# Altium schematic sheet Sheet1.SchDoc
size A2
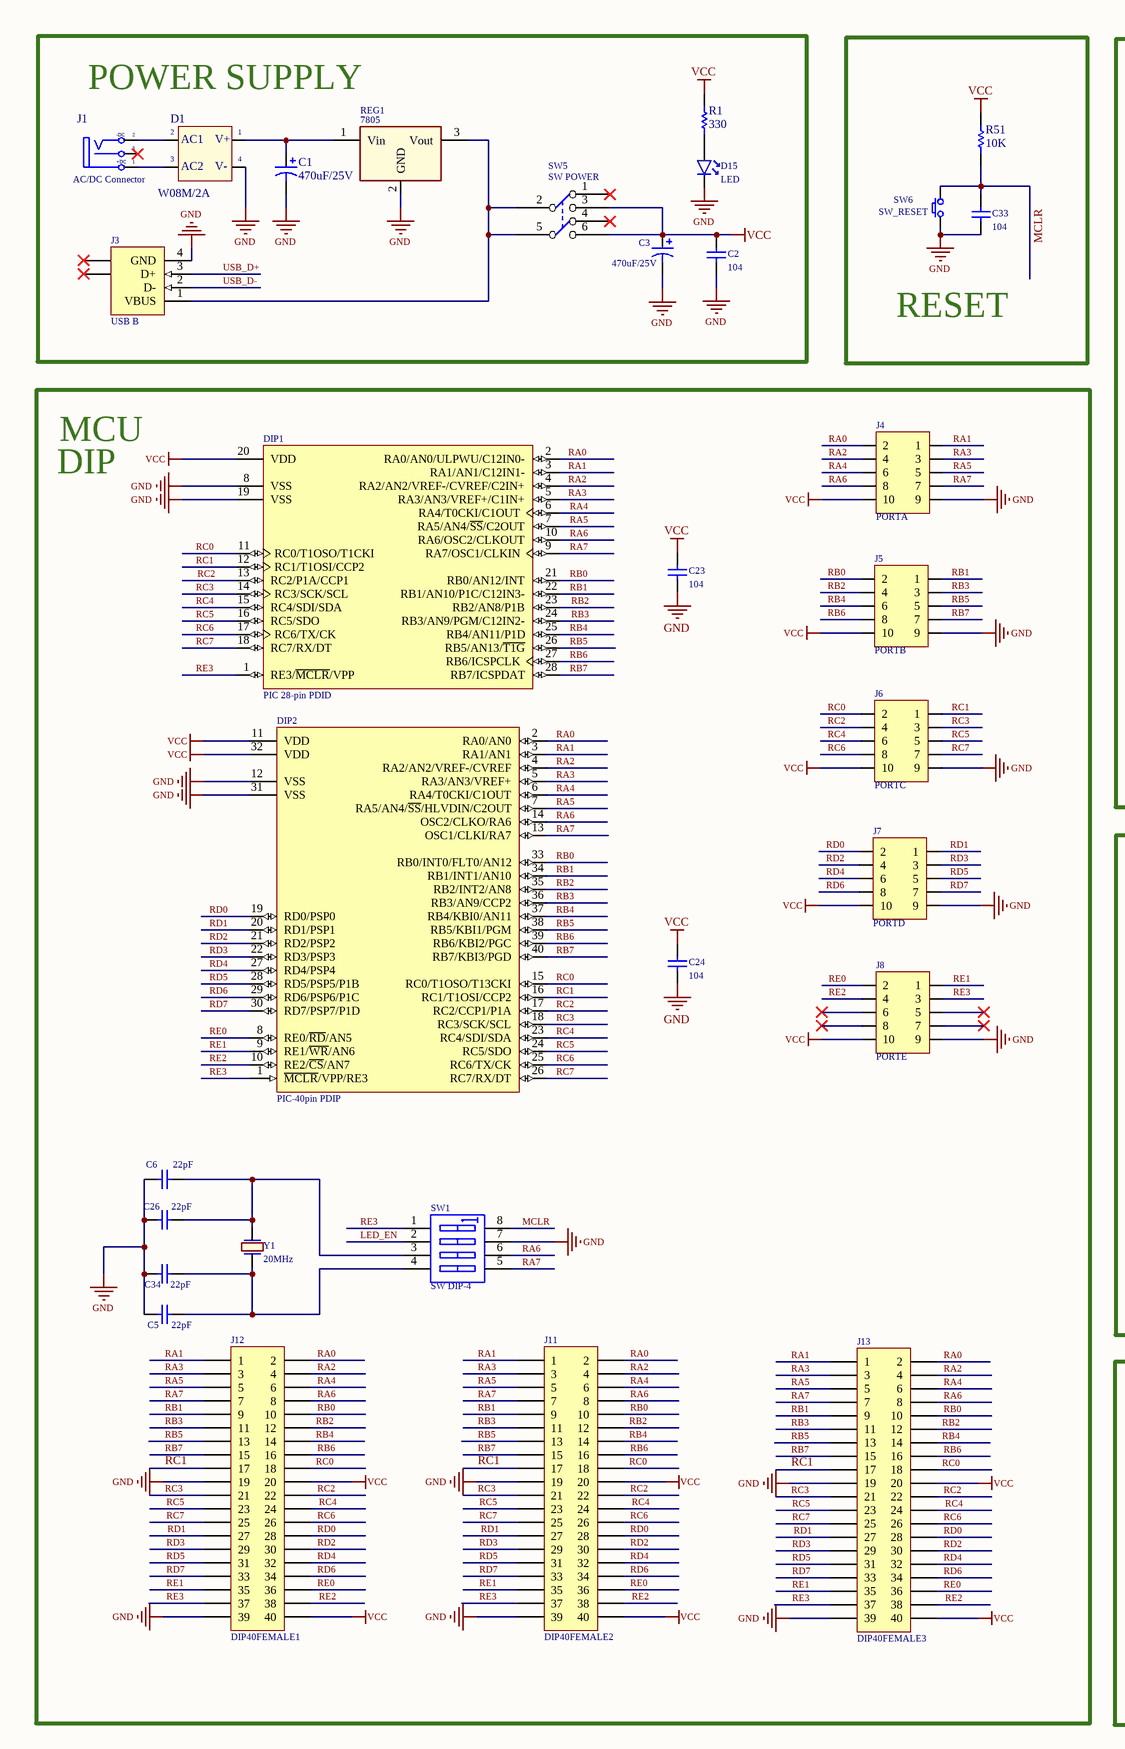
[diagram p0: Sheet1.SchDoc, left]
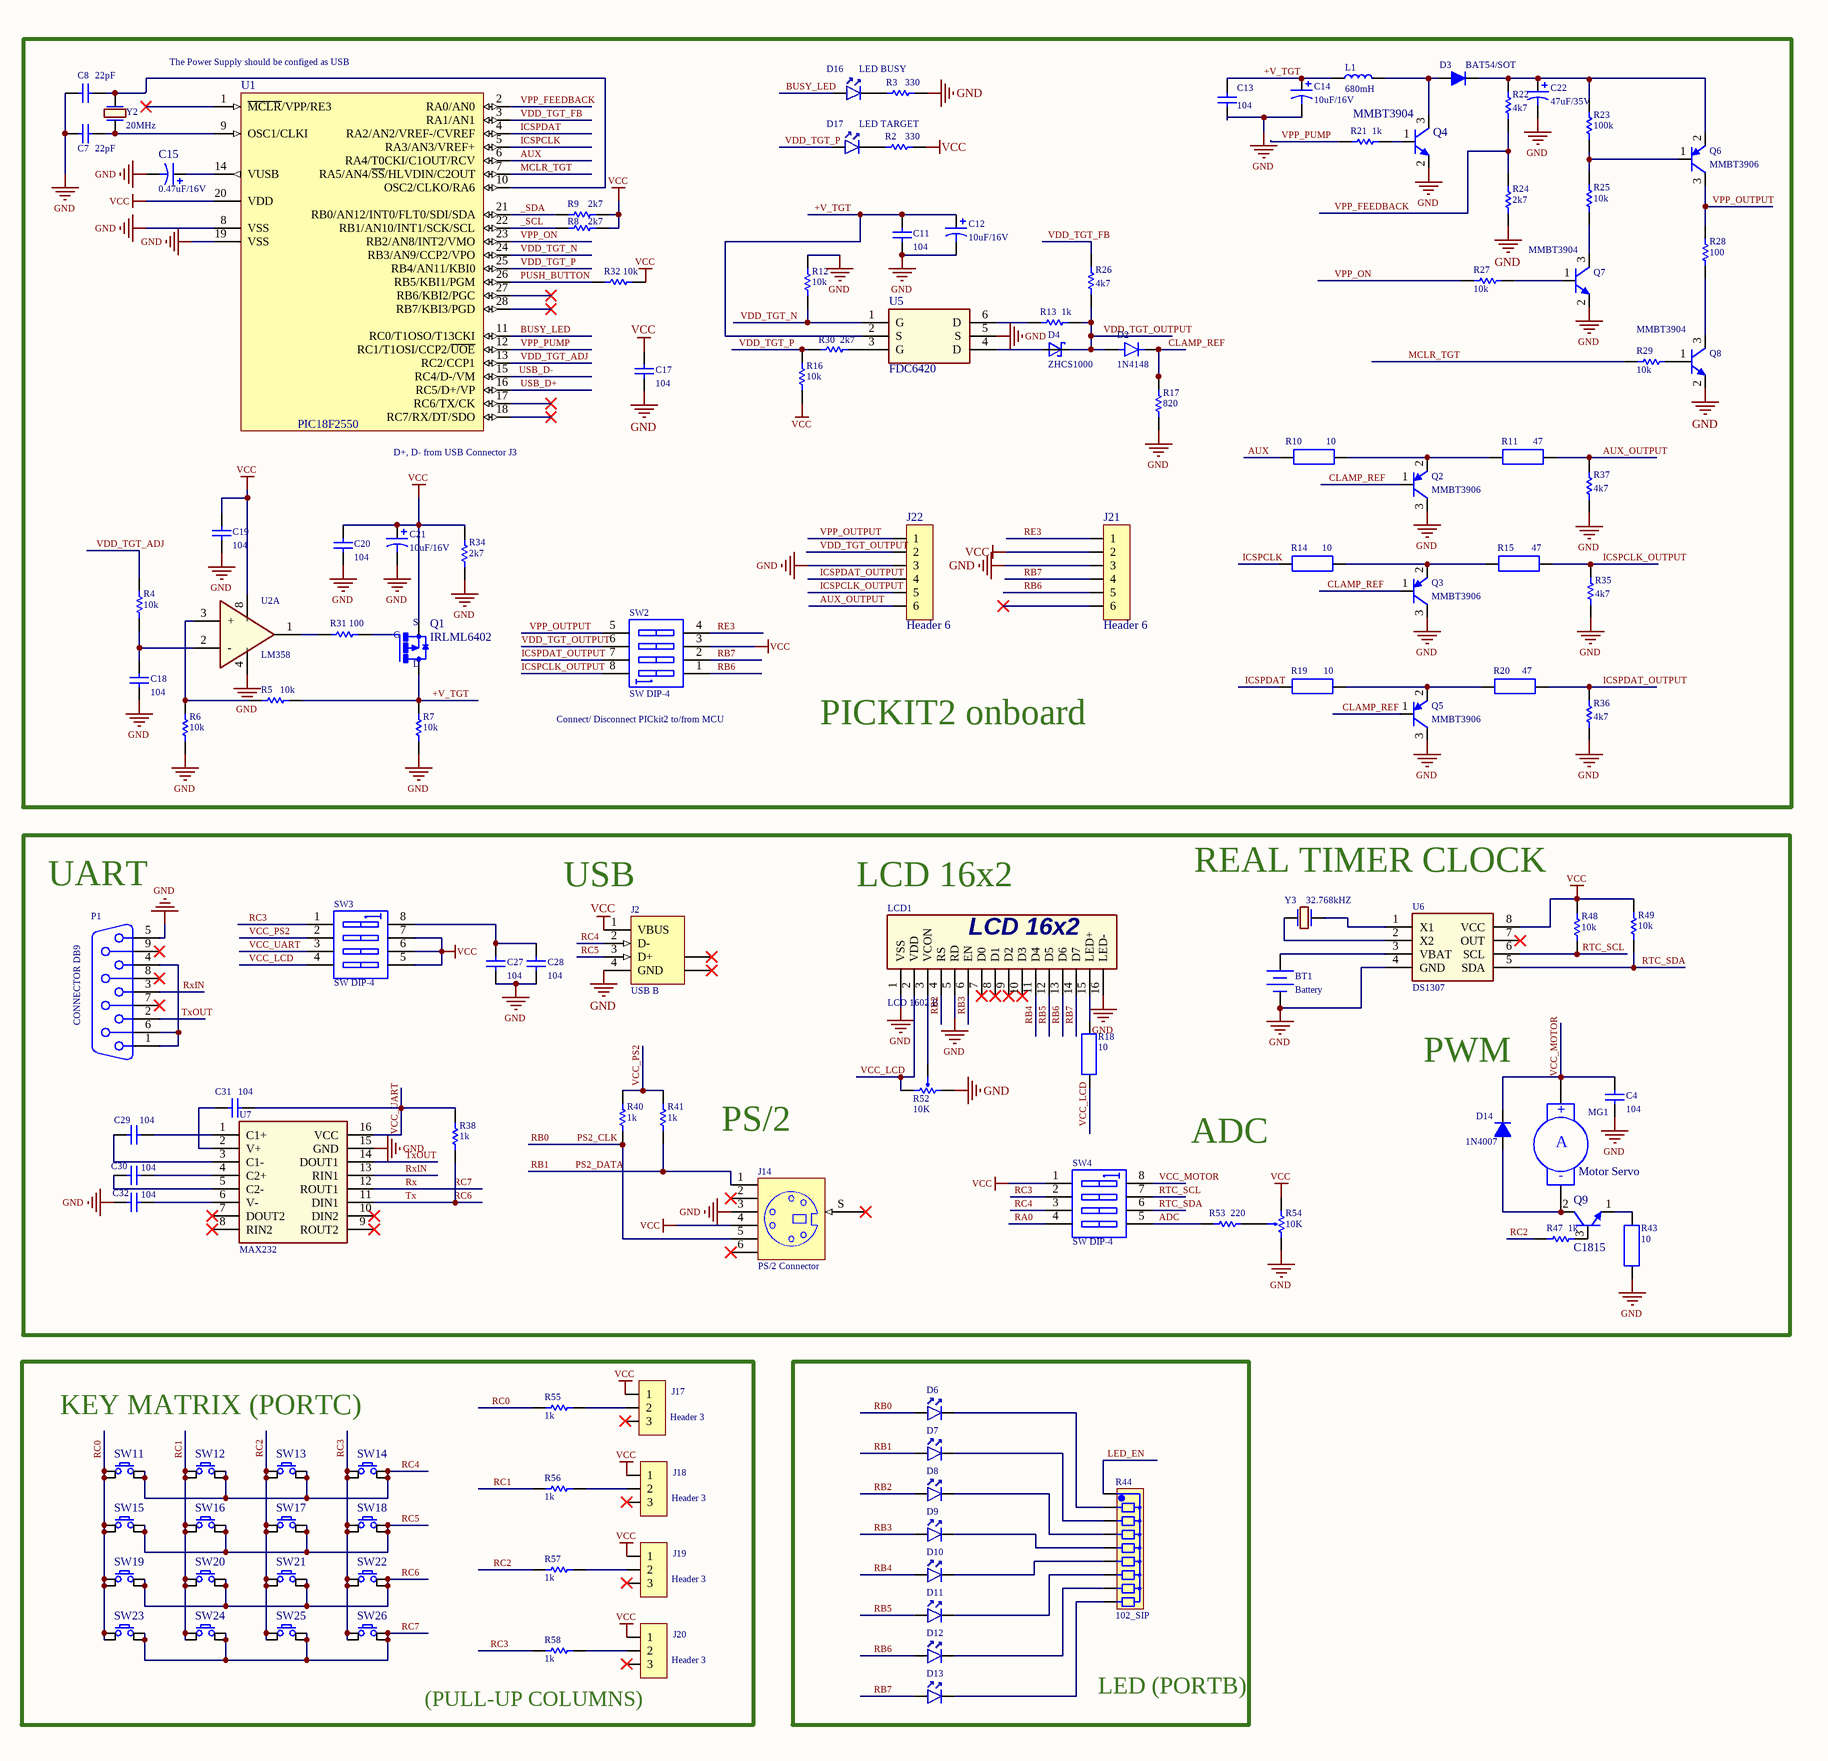
[diagram p1: Sheet1.SchDoc, right]

## Parts
BT1  Battery  [CON CR2032]
C1  470uF/25V  [CYL/D.300/LS.150/.031]
C2  104  [C 104]
C3  470uF/25V  [CYL/D.300/LS.150/.031]
C4  104  [C 0805 (2012)]
C5  22pF  [C 0805 (2012)]
C6  22pF  [C 0805 (2012)]
C7  22pF  [C 0805 (2012)]
C8  22pF  [C 0805 (2012)]
C11  104  [C 0805 (2012)]
C12  10uF/16V  [C5mm]
C13  104  [C 0805 (2012)]
C14  10uF/16V  [C5mm]
C15  0.47uF/16V  [C5mm]
C17  104  [C 0805 (2012)]
C18  104  [C 0805 (2012)]
C19  104  [C 0805 (2012)]
C20  104  [C 0805 (2012)]
C21  10uF/16V  [C5mm]
C22  47uF/35V  [C5mm]
C23  104  [C 0805 (2012)]
C24  104  [C 0805 (2012)]
C26  22pF  [C 0805 (2012)]
C27  104  [C 0805 (2012)]
C28  104  [C 0805 (2012)]
C29  104  [C 0805 (2012)]
C30  104  [C 0805 (2012)]
C31  104  [C 0805 (2012)]
C32  104  [C 0805 (2012)]
C33  104  [C 0805 (2012)]
C34  22pF  [C 0805 (2012)]
D1  W08M/2A  [BRIDGE DIODE 2A]
D2  1N4148  [SOT-23]
D3  BAT54/SOT  [SOT-23]
D4  ZHCS1000  [SOT-23]
D6  IR LED  [LED 3MM]  (value not drawn)
D7  IR LED  [LED 3MM]  (value not drawn)
D8  IR LED  [LED 3MM]  (value not drawn)
D9  IR LED  [LED 3MM]  (value not drawn)
D10  IR LED  [LED 3MM]  (value not drawn)
D11  IR LED  [LED 3MM]  (value not drawn)
D12  IR LED  [LED 3MM]  (value not drawn)
D13  IR LED  [LED 3MM]  (value not drawn)
D14  1N4007  [D1A]
D15  LED  [LED 3MM]
D16  LED BUSY  [LED 3MM]
D17  LED TARGET  [LED 3MM]
DIP1  PIC 28-pin PDID  [SPDIP300-SP28]
DIP2  PIC-40pin PDIP  [PDIP600-P40]
J1  AC/DC Connector  [CON PWR 5MM]
J2  USB B  [CON USB B]
J3  USB B  [CON USB B]
J4  PORTA  [Header 5x2]
J5  PORTB  [Header 5x2]
J6  PORTC  [Header 5x2]
J7  PORTD  [Header 5x2]
J8  PORTE  [Header 5x2]
J11  DIP40FEMALE2  [HDR2X20]
J12  DIP40FEMALE1  [HDR2X20]
J13  DIP40FEMALE3  [HDR2X20]
J14  PS/2 Connector  [PS2-6PIN]
J17  Header 3  [Header 3]
J18  Header 3  [Header 3]
J19  Header 3  [Header 3]
J20  Header 3  [Header 3]
J21  Header 6  [Header 6]
J22  Header 6  [Header 6]
L1  680mH  [R 1/2W]
LCD1  LCD 1602 B  [LCD 16x2]
MG1  Motor Servo  [R 1206 (3216)]
P1  CONNECTOR DB9  [CON DB9 FEMALE ROTATY]
Q1  IRLML6402  [SOT23]
Q2  MMBT3906  [SOT-23]
Q3  MMBT3906  [SOT-23]
Q4  MMBT3904  [SOT-23]
Q5  MMBT3906  [SOT-23]
Q6  MMBT3906  [SOT-23]
Q7  MMBT3904  [SOT-23]
Q8  MMBT3904  [SOT-23]
Q9  C1815  [TO-126]
R1  330  [R 1/4W]
R2  330  [R 1/4W]
R3  330  [R 1/4W]
R4  10k  [R 1/4W]
R5  10k  [R 1/4W]
R6  10k  [R 1/4W]
R7  10k  [R 1/4W]
R8  2k7  [R 1/4W]
R9  2k7  [R 1/4W]
R10  10  [R 1/4W]
R11  47  [R 1/4W]
R12  10k  [R 1/4W]
R13  1k  [R 1/4W]
R14  10  [R 1/4W]
R15  47  [R 1/4W]
R16  10k  [R 1/4W]
R17  820  [R 1/4W]
R18  10  [R 1/4W]
R19  10  [R 1/4W]
R20  47  [R 1/4W]
R21  1k  [R 1/4W]
R22  4k7  [R 1/4W]
R23  100k  [R 1/4W]
R24  2k7  [R 1/4W]
R25  10k  [R 1/4W]
R26  4k7  [R 1/4W]
R27  10k  [R 1/4W]
R28  100  [R 1/4W]
R29  10k  [R 1/4W]
R30  2k7  [R 1/4W]
R31  100  [R 1/4W]
R32  10k  [R 1/4W]
R34  2k7  [R 1/4W]
R35  4k7  [R 1/4W]
R36  4k7  [R 1/4W]
R37  4k7  [R 1/4W]
R38  1k  [R 1/4W]
R40  1k  [R 1/4W]
R41  1k  [R 1/4W]
R43  10  [R 1/4W]
R44  102_SIP  [RN8]
R47  1k  [R 1/4W]
R48  10k  [R 1/4W]
R49  10k  [R 1/4W]
R51  10K  [R 1/4W]
R52  10K  [R VAR D]
R53  220  [R 1/4W]
R54  10K  [R VAR B]
R55  1k  [R 1/4W]
R56  1k  [R 1/4W]
R57  1k  [R 1/4W]
R58  1k  [R 1/4W]
REG1  7805  [TO-220/HeatSink]
SW1  SW DIP-4  [SW/DIP4]
SW2  SW DIP-4  [SW/DIP4]
SW3  SW DIP-4  [SW/DIP4]
SW4  SW DIP-4  [SW/DIP4]
SW5  SW POWER  [SW/6/DPDT/PUSH]
SW6  SW_RESET  [SW/2/DIP]
SW11  Tact Switch  [SW/4/SMD/SMALL]  (value not drawn)
SW12  Tact Switch  [SW/4/SMD/SMALL]  (value not drawn)
SW13  Tact Switch  [SW/4/SMD/SMALL]  (value not drawn)
SW14  Tact Switch  [SW/4/SMD/SMALL]  (value not drawn)
SW15  Tact Switch  [SW/4/SMD/SMALL]  (value not drawn)
SW16  Tact Switch  [SW/4/SMD/SMALL]  (value not drawn)
SW17  Tact Switch  [SW/4/SMD/SMALL]  (value not drawn)
SW18  Tact Switch  [SW/4/SMD/SMALL]  (value not drawn)
SW19  Tact Switch  [SW/4/SMD/SMALL]  (value not drawn)
SW20  Tact Switch  [SW/4/SMD/SMALL]  (value not drawn)
SW21  Tact Switch  [SW/4/SMD/SMALL]  (value not drawn)
SW22  Tact Switch  [SW/4/SMD/SMALL]  (value not drawn)
SW23  Tact Switch  [SW/4/SMD/SMALL]  (value not drawn)
SW24  Tact Switch  [SW/4/SMD/SMALL]  (value not drawn)
SW25  Tact Switch  [SW/4/SMD/SMALL]  (value not drawn)
SW26  Tact Switch  [SW/4/SMD/SMALL]  (value not drawn)
U1  PIC18F2550  [SPDIP300-SP28]
U2  LM358  [SOIC-8]  (part A of 2)
U5  FDC6420  [SOT-6]
U6  DS1307  [DIP 8]
U7  MAX232  [SOIC-16]
Y1  20MHz  [Crystal HC49S DIP]
Y2  20MHz  [Crystal HC49S DIP]
Y3  32.768kHZ  [Crystal DIP-2]

## Blocks framed on the sheet
POWER SUPPLY: C1-C3 D1 D15 J1 J3 R1 REG1 SW5
RESET: C33 R51 SW6
PICKIT2 onboard: C7 C8 C11-C15 C17-C22 D2-D4 D16 D17 J21 J22 L1 Q1-Q8 R2-R17 R19-R32 R34-R37 SW2 U1 U2 U5 Y2
KEY MATRIX (PORTC): J17-J20 R55-R58 SW11-SW26
LED (PORTB): D6-D13 R44

## Nets
GND: BT1.2(GND) C1.2 C2.2 C3.2 C4.2 C5.1 C6.1 C7.1 C8.1 C11.2 C12.2 C13.2 C14.2 C15.2 C17.2 C18.2 C19.2 C20.2 C21.2 C22.2 C23.2 C24.2 C26.1 C27.2 C28.2 C32.1 C33.2 C34.1 D1.4(-V_OUT) D15.2(K) DIP1.8(VSS) DIP1.19(VSS) DIP2.12(VSS) DIP2.31(VSS) J2.4(GND) J3.4(GND) J4.9 J5.9 J6.9 J7.9 J8.9 J11.19 J11.39 J12.19 J12.39 J13.19 J13.39 J14.3 J21.3 J22.3 LCD1.1(VSS) LCD1.5(RD) LCD1.16(LED-) P1.5 Q2.3(C) Q3.3(C) Q4.2(E) Q5.3(C) Q7.2(E) Q8.2(E) R3.1 R6.1 R7.1 R12.2 R17.1 R24.1 R34.1 R35.1 R36.1 R37.1 R43.1 R52.3 R54.1 REG1.2(GND) SW1.7 SW6.1 U1.8(VSS) U1.19(VSS) U2.4(GND) U5.5(S) U6.4(GND) U7.15(GND)
VCC: C2.1 C3.1 C17.1 C19.1 C20.1 C21.1 C23.1 C24.1 DIP1.20(VDD) DIP2.11(VDD) DIP2.32(VDD) J2.1(VBUS) J4.10 J5.10 J6.10 J7.10 J8.10 J11.20 J11.40 J12.20 J12.40 J13.20 J13.40 J14.4 J17.1 J18.1 J19.1 J20.1 J21.2 Q1.2(S) R1.2 R2.1 R8.2 R9.2 R16.1 R32.2 R34.2 R48.2 R49.2 R51.2 R54.3 SW2.3 SW3.5 SW3.6 SW3.7 SW4.1 SW5.3(NO1) SW5.6(NO2) U1.20(VDD) U2.8(VCC) U6.8(VCC)
+V_TGT: C11.1 C12.1 C13.1 C14.1 L1.1 Q1.3(D) R5.2 R7.2 U5.2(S)
_SCL: R8.1 U1.22(RB1/AN10/INT1/SCK/SCL)
_SDA: R9.1 U1.21(RB0/AN12/INT0/FLT0/SDI/SDA)
ADC: R53.1 SW4.5
AUX: R10.1 U1.6(RA4/T0CKI/C1OUT/RCV)
AUX_OUTPUT: J22.6 R11.2 R37.2
BUSY_LED: D16.1(A) U1.11(RC0/T1OSO/T13CKI)
CLAMP_REF: D2.C Q2.1(B) Q3.1(B) Q5.1(B) R17.2
ICSPCLK: R14.1 U1.5(RA3/AN3/VREF+)
ICSPCLK_OUTPUT: J22.5 R15.2 R35.2 SW2.8
ICSPDAT: R19.1 U1.4(RA2/AN2/VREF-/CVREF)
ICSPDAT_OUTPUT: J22.4 R20.2 R36.2 SW2.7
LED_EN: R44.1 SW1.2
MCLR: C33.1 R51.1 SW1.8 SW6.2
MCLR_TGT: R29.2 U1.7(RA5/AN4/~{SS}/HLVDIN/C2OUT)
PS2_CLK: D6.1(A) DIP1.21(RB0/AN12/INT) DIP2.33(RB0/INT0/FLT0/AN12) J5.2 J11.10 J12.10 J13.10 J14.5 R40.1  [also labelled RB0]
PS2_DATA: D7.1(A) DIP1.22(RB1/AN10/P1C/C12IN3-) DIP2.34(RB1/INT1/AN10) J5.1 J11.9 J12.9 J13.9 J14.1 R41.1  [also labelled RB1]
PUSH_BUTTON: R32.1 U1.26(RB5/KBI1/PGM)
RA0: DIP1.2(RA0/AN0/ULPWU/C12IN0-) DIP2.2(RA0/AN0) J4.2 J11.2 J12.2 J13.2 SW4.4
RA1: DIP1.3(RA1/AN1/C12IN1-) DIP2.3(RA1/AN1) J4.1 J11.1 J12.1 J13.1
RA2: DIP1.4(RA2/AN2/VREF-/CVREF/C2IN+) DIP2.4(RA2/AN2/VREF-/CVREF) J4.4 J11.4 J12.4 J13.4
RA3: DIP1.5(RA3/AN3/VREF+/C1IN+) DIP2.5(RA3/AN3/VREF+) J4.3 J11.3 J12.3 J13.3
RA4: DIP1.6(RA4/T0CKI/C1OUT) DIP2.6(RA4/T0CKI/C1OUT) J4.6 J11.6 J12.6 J13.6
RA5: DIP1.7(RA5/AN4/~{SS}/C2OUT) DIP2.7(RA5/AN4/~{SS}/HLVDIN/C2OUT) J4.5 J11.5 J12.5 J13.5
RA6: DIP1.10(RA6/OSC2/CLKOUT) DIP2.14(OSC2/CLKO/RA6) J4.8 J11.8 J12.8 J13.8 SW1.6
RA7: DIP1.9(RA7/OSC1/CLKIN) DIP2.13(OSC1/CLKI/RA7) J4.7 J11.7 J12.7 J13.7 SW1.5
RB2: D8.1(A) DIP1.23(RB2/AN8/P1B) DIP2.35(RB2/INT2/AN8) J5.4 J11.12 J12.12 J13.12 LCD1.4(RS)
RB3: D9.1(A) DIP1.24(RB3/AN9/PGM/C12IN2-) DIP2.36(RB3/AN9/CCP2) J5.3 J11.11 J12.11 J13.11 LCD1.6(EN)
RB4: D10.1(A) DIP1.25(RB4/AN11/P1D) DIP2.37(RB4/KBI0/AN11) J5.6 J11.14 J12.14 J13.14 LCD1.11(D4)
RB5: D11.1(A) DIP1.26(RB5/AN13/~{T1G}) DIP2.38(RB5/KBI1/PGM) J5.5 J11.13 J12.13 J13.13 LCD1.12(D5)
RB6: D12.1(A) DIP1.27(RB6/ICSPCLK) DIP2.39(RB6/KBI2/PGC) J5.8 J11.16 J12.16 J13.16 J21.5 LCD1.13(D6) SW2.1
RB7: D13.1(A) DIP1.28(RB7/ICSPDAT) DIP2.40(RB7/KBI3/PGD) J5.7 J11.15 J12.15 J13.15 J21.4 LCD1.14(D7) SW2.2
RC0: DIP1.11(RC0/T1OSO/T1CKI) DIP2.15(RC0/T1OSO/T13CKI) J6.2 J11.18 J12.18 J13.18 R55.2 SW11.1 SW11.4 SW15.1 SW15.4 SW19.1 SW19.4 SW23.1 SW23.4
RC1: DIP1.12(RC1/T1OSI/CCP2) DIP2.16(RC1/T1OSI/CCP2) J6.1 J11.17 J12.17 J13.17 R56.2 SW12.1 SW12.4 SW16.1 SW16.4 SW20.1 SW20.4 SW24.1 SW24.4
RC2: DIP1.13(RC2/P1A/CCP1) DIP2.17(RC2/CCP1/P1A) J6.4 J11.22 J12.22 J13.22 R47.1 R57.2 SW13.1 SW13.4 SW17.1 SW17.4 SW21.1 SW21.4 SW25.1 SW25.4
RC3: DIP1.14(RC3/SCK/SCL) DIP2.18(RC3/SCK/SCL) J6.3 J11.21 J12.21 J13.21 R58.2 SW3.1 SW4.2 SW14.1 SW14.4 SW18.1 SW18.4 SW22.1 SW22.4 SW26.1 SW26.4
RC4: DIP1.15(RC4/SDI/SDA) DIP2.23(RC4/SDI/SDA) J2.2(D-) J6.6 J11.24 J12.24 J13.24 SW4.3 SW11.2 SW11.3 SW12.2 SW12.3 SW13.2 SW13.3 SW14.2 SW14.3
RC5: DIP1.16(RC5/SDO) DIP2.24(RC5/SDO) J2.3(D+) J6.5 J11.23 J12.23 J13.23 SW15.2 SW15.3 SW16.2 SW16.3 SW17.2 SW17.3 SW18.2 SW18.3
RC6: DIP1.17(RC6/TX/CK) DIP2.25(RC6/TX/CK) J6.8 J11.26 J12.26 J13.26 R38.1 SW19.2 SW19.3 SW20.2 SW20.3 SW21.2 SW21.3 SW22.2 SW22.3 U7.11(DIN1)  [also labelled Tx]
RC7: DIP1.18(RC7/RX/DT) DIP2.26(RC7/RX/DT) J6.7 J11.25 J12.25 J13.25 SW23.2 SW23.3 SW24.2 SW24.3 SW25.2 SW25.3 SW26.2 SW26.3 U7.12(ROUT1)  [also labelled Rx]
RD0: DIP2.19(RD0/PSP0) J7.2 J11.28 J12.28 J13.28
RD1: DIP2.20(RD1/PSP1) J7.1 J11.27 J12.27 J13.27
RD2: DIP2.21(RD2/PSP2) J7.4 J11.30 J12.30 J13.30
RD3: DIP2.22(RD3/PSP3) J7.3 J11.29 J12.29 J13.29
RD4: DIP2.27(RD4/PSP4) J7.6 J11.32 J12.32 J13.32
RD5: DIP2.28(RD5/PSP5/P1B) J7.5 J11.31 J12.31 J13.31
RD6: DIP2.29(RD6/PSP6/P1C) J7.8 J11.34 J12.34 J13.34
RD7: DIP2.30(RD7/PSP7/P1D) J7.7 J11.33 J12.33 J13.33
RE0: DIP2.8(RE0/~{RD}/AN5) J8.2 J11.36 J12.36 J13.36
RE1: DIP2.9(RE1/~{WR}/AN6) J8.1 J11.35 J12.35 J13.35
RE2: DIP2.10(RE2/~{CS}/AN7) J8.4 J11.38 J12.38 J13.38
RE3: DIP1.1(RE3/~{MCLR}/VPP) DIP2.1(~{MCLR}/VPP/RE3) J8.3 J11.37 J12.37 J13.37 J21.1 SW1.1 SW2.4
RTC_SCL: R48.1 SW4.7 U6.6(SCL)
RTC_SDA: R49.1 SW4.6 U6.5(SDA)
RxIN: P1.3 U7.13(RIN1)
TxOUT: P1.2 U7.14(DOUT1)
USB_D+: J3.3(D+) U1.16(RC5/D+/VP)
USB_D-: J3.2(D-) U1.15(RC4/D-/VM)
VCC_LCD: LCD1.2(VDD) R18.1 R52.1 SW3.4
VCC_MOTOR: C4.1 D14.2(K) MG1.1(+) SW4.8
VCC_PS2: R40.2 R41.2 SW3.2
VCC_UART: C31.2 R38.2 SW3.3 U7.16(VCC)
VDD_TGT_ADJ: R4.2 U1.13(RC2/CCP1)
VDD_TGT_FB: R26.2 U1.3(RA1/AN1)
VDD_TGT_N: R12.1 U1.24(RB3/AN9/CCP2/VPO) U5.1(G)
VDD_TGT_OUTPUT: D2.A D4.1(K) J22.2 R13.2 R26.1 SW2.6
VDD_TGT_P: D17.1(A) R16.2 R30.1 U1.25(RB4/AN11/KBI0)
VPP_FEEDBACK: R22.1 R24.2 U1.2(RA0/AN0)
VPP_ON: R27.2 U1.23(RB2/AN8/INT2/VMO)
VPP_OUTPUT: J22.1 Q6.3(C) R28.2 SW2.5
VPP_PUMP: R21.1 U1.12(RC1/T1OSI/CCP2/~{UOE})
NetBT1_1: BT1.1(VCC) U6.3(VBAT)
NetC1_1: C1.1 D1.1(+V_OUT) REG1.1(Vin)
NetC5_2: C5.2 C34.2 SW1.4 Y1.1
NetC6_2: C6.2 C26.2 SW1.3 Y1.2
NetC7_2: C7.2 U1.9(OSC1/CLKI) Y2.1
NetC8_2: C8.2 U1.10(OSC2/CLKO/RA6) Y2.2
NetC15_1: C15.1 U1.14(VUSB)
NetC18_1: C18.1 R4.1 U2.2(-)
NetC22_1: C22.1 D3.2(K) Q6.2(E) R22.2 R23.2
NetC27_1: C27.1 C28.1 SW3.8
NetC29_1: C29.1 U7.3(C1-)
NetC29_2: C29.2 U7.1(C1+)
NetC30_1: C30.1 U7.5(C2-)
NetC30_2: C30.2 U7.4(C2+)
NetC31_1: C31.1 U7.2(V+)
NetC32_2: C32.2 U7.6(V-)
NetD1_2: D1.2(AC1) J1.2(TN)
NetD1_3: D1.3(AC2) J1.1(T)
NetD3_1: D3.1(A) L1.2 Q4.3(C)
NetD4_3: D4.3(A) U5.4(D)
NetD6_2: D6.2(K) R44.2
NetD7_2: D7.2(K) R44.3
NetD8_2: D8.2(K) R44.4
NetD9_2: D9.2(K) R44.5
NetD10_2: D10.2(K) R44.6
NetD11_2: D11.2(K) R44.7
NetD12_2: D12.2(K) R44.8
NetD13_2: D13.2(K) R44.9
NetD14_1: D14.1(A) MG1.2(-) Q9.2(C)
NetD15_1: D15.1(A) R1.1
NetD16_2: D16.2(K) R3.2
NetD17_2: D17.2(K) R2.2
NetJ3_1: J3.1(VBUS) REG1.3(Vout) SW5.2(COMMON1) SW5.5(COMMON2)
NetJ17_2: J17.2 R55.1
NetJ18_2: J18.2 R56.1
NetJ19_2: J19.2 R57.1
NetJ20_2: J20.2 R58.1
NetLCD1_3: LCD1.3(VCON) R52.2
NetLCD1_15: LCD1.15(LED+) R18.2
NetP1_1: P1.1 P1.4 P1.6
NetQ1_1: Q1.1(G) R31.2
NetQ2_2: Q2.2(E) R10.2 R11.1
NetQ3_2: Q3.2(E) R14.2 R15.1
NetQ4_1: Q4.1(B) R21.2
NetQ5_2: Q5.2(E) R19.2 R20.1
NetQ6_1: Q6.1(B) R23.1 R25.2
NetQ7_1: Q7.1(B) R27.1
NetQ7_3: Q7.3(C) R25.1
NetQ8_1: Q8.1(B) R29.1
NetQ8_3: Q8.3(C) R28.1
NetQ9_1: Q9.1(E) R43.2
NetQ9_3: Q9.3(B) R47.2
NetR5_1: R5.1 R6.2 U2.3(+)
NetR13_1: R13.1 U5.6(D)
NetR30_2: R30.2 U5.3(G)
NetR31_1: R31.1 U2.1(OutA)
NetR53_2: R53.2 R54.2
NetU6_1: U6.1(X1) Y3.2
NetU6_2: U6.2(X2) Y3.1

Not connected (* = marked no-connect by the designer): J1 3(S)*; J2 5(SHLD)* 6(SHLD)*; J3 5(SHLD)* 6(SHLD)*; J8 5* 6* 7* 8*; J14 2* 6* S*; J17 3*; J18 3*; J19 3*; J20 3*; J21 6*; LCD1 7(D0)* 8(D1)* 9(D2)* 10(D3)*; P1 7* 8* 9*; SW5 1(NC1)* 4(NC2)*; U1 1(~{MCLR}/VPP/RE3)* 17(RC6/TX/CK)* 18(RC7/RX/DT/SDO)* 27(RB6/KBI2/PGC)* 28(RB7/KBI3/PGD)*; U6 7(OUT)*; U7 7(DOUT2)* 8(RIN2)* 9(ROUT2)* 10(DIN2)*

## Notes on the sheet
- (near U1) The Power Supply should be configed as USB
- DIP
- MCU
- (near U1) D+, D- from USB Connector J3
- (near SW2) Connect/ Disconnect PICkit2 to/from MCU
- (near P1) UART
- (near J2) USB
- LCD 16x2
- REAL TIMER CLOCK
- PWM
- PS/2
- ADC
- (PULL-UP COLUMNS)
- (in symbol CON DC PWR) -DC; +DC
- (in symbol Diode Bridge) V+; V-
- (in symbol Motor Servo) A

## Library data of the parts
C1 C3 = Cap Pol 8mm: Polarized Capacitor (Axial); Published: 8-Jun-2000; LatestRevisionDate: 17-Jul-2002; LatestRevisionNote: Re-released for DXP Platform.; PackageReference: POLAR0.8; Publisher: Altium Limited
C2 C4-C8 C11 C13 C17-C20 C23 C24 C26-C34 = Capacitor NP: Capacitor non-pol
C12 C14 C15 C21 C22 = Cap Pol 5mm: Polarized Capacitor (Axial); Published: 8-Jun-2000; LatestRevisionDate: 17-Jul-2002; LatestRevisionNote: Re-released for DXP Platform.; PackageReference: POLAR0.8; Publisher: Altium Limited
D1 = Diode Bridge: Convert AC to DC voltage, 4 pin; Value: Cau 1A
D2 = 1N4148: DIODE FAST SIGNAL 500MA/100V; pin to pad: A>1 C>3; MF: MICROSS/On Semiconductor; SnapEDA_Link: https://www.snapeda.com/parts/1N4148/MICROSS/On%20Semiconductor/view-part/9246/?ref=snap; MP: 1N4148; Availability: Unavailable; Price: None; Value: *; Package: DO-35 Fairchild Semiconductor
D3 = Diode: Default Diode; pin to pad: 2>3; Published: 8-Jun-2000; LatestRevisionDate: 17-Jul-2002; LatestRevisionNote: Re-released for DXP Platform.; PackageVersion: Sep-1996; PackageReference: SMC; Publisher: Altium Limited; Code_JEDEC: DO-214-AB
D4 = ZHCS1000: Diode Schottky 40V 1A _DC_ Surface Mount SOT-23-3; pin to pad: 3>2; MF: Diodes Inc.; Package: SOT-23 Diodes Inc.; MP: ZHCS1000; Availability: Unavailable; Price: None; Value: *; SnapEDA_Link: https://www.snapeda.com/parts/ZHCS1000/Diodes%20Inc./view-part/53280/?ref=snap
D14 = D1A: Diode 1A; Value: 1N4007
D15-D17 = IR Led: Published: 8-Jun-2000; LatestRevisionDate: 17-Jul-2002; LatestRevisionNote: Re-released for DXP Platform.; PackageReference: AXIAL-0.3; Publisher: Altium Limited
DIP1 = PIC16F886-I/SP: Flash-Based, 8-Bit CMOS Microcontroller with nanoWatt Technology, 8K (x14-Bit words) Program Memory, 624 Bytes Data Memory, 24 I/O pins, 28-Pin SPDIP, Standard VDD Range, Industrial Temperature; Published: 29-Jan-2009; LatestRevisionDate: 02-Dec-2009; LatestRevisionNote: Updated datasheet to version revF, Apr-2009.; DatasheetVersion: revF, Apr-2009; PackageVersion: revBB, Aug-2009; PackageReference: SPDIP300-SP28; Publisher: Altium Limited; PackageDescription: 28-Lead Skinny Plastic Dual In-Line (SP) - 300 mil Body [SPDIP]; Supplier 1: Digi-Key; Supplier Part Number 1: PIC16F886-I/SP-ND; Supplier 2: Farnell; Supplier Part Number 2: 1439539; ComponentLink1Description: Datasheet; ComponentLink1URL: http://ww1.microchip.com/downloads/en/DeviceDoc/41291F.pdf; ComponentLink2Description: Packaging Specification; ComponentLink2URL: http://www.microchip.com/stellent/groups/techpub_sg/documents/packagingspec/en012702.pdf; ComponentLink3Description: Microchip.com Home; ComponentLink3URL: http://www.microchip.com/
DIP2 = PIC18F4620-I/P: Enhanced Flash Microcontroller with 10-Bit A/D and nanoWatt Technology, 64K Flash, 40-Pin PDIP, Industrial Temperature Range; Published: 29-Jan-2009; DatasheetVersion: revE, May-2008; PackageVersion: revBB, Aug-2009; PackageReference: PDIP600-P40; Publisher: Altium Limited; PackageDescription: 40-Lead Plastic Dual In-Line (P) - 600 mil Body [PDIP]; Supplier 1: Digi-Key; Supplier Part Number 1: PIC18F4620-I/P-ND; Supplier 2: Farnell; Supplier Part Number 2: 1212704; Supplier 3: Farnell; Supplier Part Number 3: 1660064; ComponentLink1Description: Datasheet; ComponentLink1URL: http://ww1.microchip.com/downloads/en/DeviceDoc/39626e.pdf; ComponentLink2Description: Packaging Specification; ComponentLink2URL: http://www.microchip.com/stellent/groups/techpub_sg/documents/packagingspec/en012702.pdf; ComponentLink3Description: Microchip.com Home; ComponentLink3URL: http://www.microchip.com/
J1 = CON DC PWR: DC input connector
J2 J3 = CON USB B: USB type B, 4 pins
J4-J8 = Header 5X2: Header, 5-Pin, Dual row; LatestRevisionDate: 17-Jul-2002; LatestRevisionNote: Re-released for DXP Platform.; Publisher: Altium Limited
J11-J13 = Header 20X2: Header, 20-Pin, Dual row; LatestRevisionDate: 17-Jul-2002; LatestRevisionNote: Re-released for DXP Platform.; Publisher: Altium Limited
J14 = PS2-6PIN: 6 Pin Through Hole PS2 Socket (Kycon P/N); Published: 17-Dec-2003; Publisher: Altium Limited; ComponentLink1Description: Manufacturer Link; ComponentLink1URL: http://www.oupiin.com/prodindx.html#Headers
J17-J20 = Header 3: Header, 3-Pin
J21 J22 = Header 6: Header, 6-Pin
L1 = Inductor
LCD1 = LCD 16x2: Character LCD 16x2
MG1 = Motor Servo: Servo Motor; Published: 24-Mar-1999; LatestRevisionDate: 17-Jul-2002; LatestRevisionNote: Re-released for DXP Platform.; PackageReference: RAD-0.4; Publisher: Altium Limited; PackageDescription: Radial Cap, Thru-Hole; 2 Leads; 0.4 in Pin Spacing
P1 = CON DB-9: Connector D-Sub 9
Q1 = IRLML6402: P-Channel 20V 3.7A _Ta_ 1.3W _Ta_ Surface Mount Micro3â„¢/SOT-23; MF: Infineon Technologies; Package: SC-59 Infineon Technologies; Value: *; Availability: Unavailable; SnapEDA_Link: https://www.snapeda.com/parts/IRLML6402/Infineon%20Technologies/view-part/2522811/?ref=snap; Price: None; MP: IRLML6402
Q2 Q3 Q5 Q6 = Transistor PNP: PNP Bipolar Transistor; Published: 8-Jun-2000; LatestRevisionDate: 29-May-2009; LatestRevisionNote: IPC-7351 Footprint Added.; PackageVersion: Aug-1999; PackageReference: SOT-23B; Publisher: Altium Limited; PackageDescription: 3-Pin SOT-23 Package 0.95 mm Pitch, 2.4 mm Lead Span
Q4 Q7 Q8 = Transistor NPN: NPN Bipolar Transistor
Q9 = Transistor NPN - C1815: NPN Bipolar Transistor
R1-R9 R12 R13 R16 R17 R21-R32 R34-R38 R40 R41 R47-R49 R51 R53 R55-R58 = Resistor: Published: 8-Jun-2000; LatestRevisionDate: 17-Jul-2002; LatestRevisionNote: Re-released for DXP Platform.; PackageReference: AXIAL-0.3; Publisher: Altium Limited
R10 R11 R14 R15 R18-R20 R43 = R1W: Resistor 1W; Value: R1W - 100
R44 = RN8: Resistor 8 (Thanh); Value: Tro thanh 10K
R52 R54 = Resistor Variable
REG1 = 78xx/78Mxx: LDO Fixed Voltage regulator
SW1-SW4 = SWDIP4: WS-DITV 2.54 mm small compact THT flat actuator with top tape; Manufacturer: Wurth Elektronik; Part No.: 418127160904; ComponentLink1 Description: Manufacturer; ComponentLink2 Description: Datasheet; Pole: 04; Created Date: Dec.2015; ComponentLink1URL: http://www.we-online.com; ComponentLink2URL: http://katalog.we-online.de/em/datasheet/4181271609xx.pdf; Created by: Baojun Chen
SW5 = SW DPDT/2S
SW6 = SW SPST: Tact switch 2 pin
SW11-SW26 = SW SPST-4: Tact switch 4 pin
U1 = PIC18F2550-I/SP: High Performance, Enhanced Flash, USB Microcontroller with nanoWatt Technology, 32K Flash, 28-Pin SPDIP, Industrial Temperature Range; Published: 29-Jan-2009; LatestRevisionDate: 02-Dec-2009; LatestRevisionNote: Updated to datasheet revision E, Aug-2008; DatasheetVersion: revE, Aug-2008; PackageVersion: revBB, Aug-2009; PackageReference: SPDIP300-SP28; Publisher: Altium Limited; PackageDescription: 28-Lead Skinny Plastic Dual In-Line (SP) - 300 mil Body [SPDIP]; Supplier 1: Digi-Key; Supplier Part Number 1: PIC18F2550-I/SP-ND; Supplier 2: Farnell; Supplier Part Number 2: 9321250; Supplier 3: Farnell; Supplier Part Number 3: 1523822; ComponentLink1Description: Datasheet; ComponentLink1URL: http://ww1.microchip.com/downloads/en/DeviceDoc/39632e.pdf; ComponentLink2Description: Packaging Specification; ComponentLink2URL: http://www.microchip.com/stellent/groups/techpub_sg/documents/packagingspec/en012702.pdf; ComponentLink3Description: Microchip.com Home; ComponentLink3URL: http://www.microchip.com/
U2 = LM358: Low Power Dual Operational Amplifiers
U5 = FDC6420: 20V N & P-Channel PowerTrenchÒ MOSFETs
U7 = MAX232: RS-232 Line Driver/Receiver
Y1-Y3 = Crystal
D6-D13 = IR Led: Published: 8-Jun-2000; LatestRevisionDate: 17-Jul-2002; LatestRevisionNote: Re-released for DXP Platform.; PackageReference: AXIAL-0.3; Publisher: Altium Limited